# EAGLE design my-forecast (EAGLE 7.7.0)
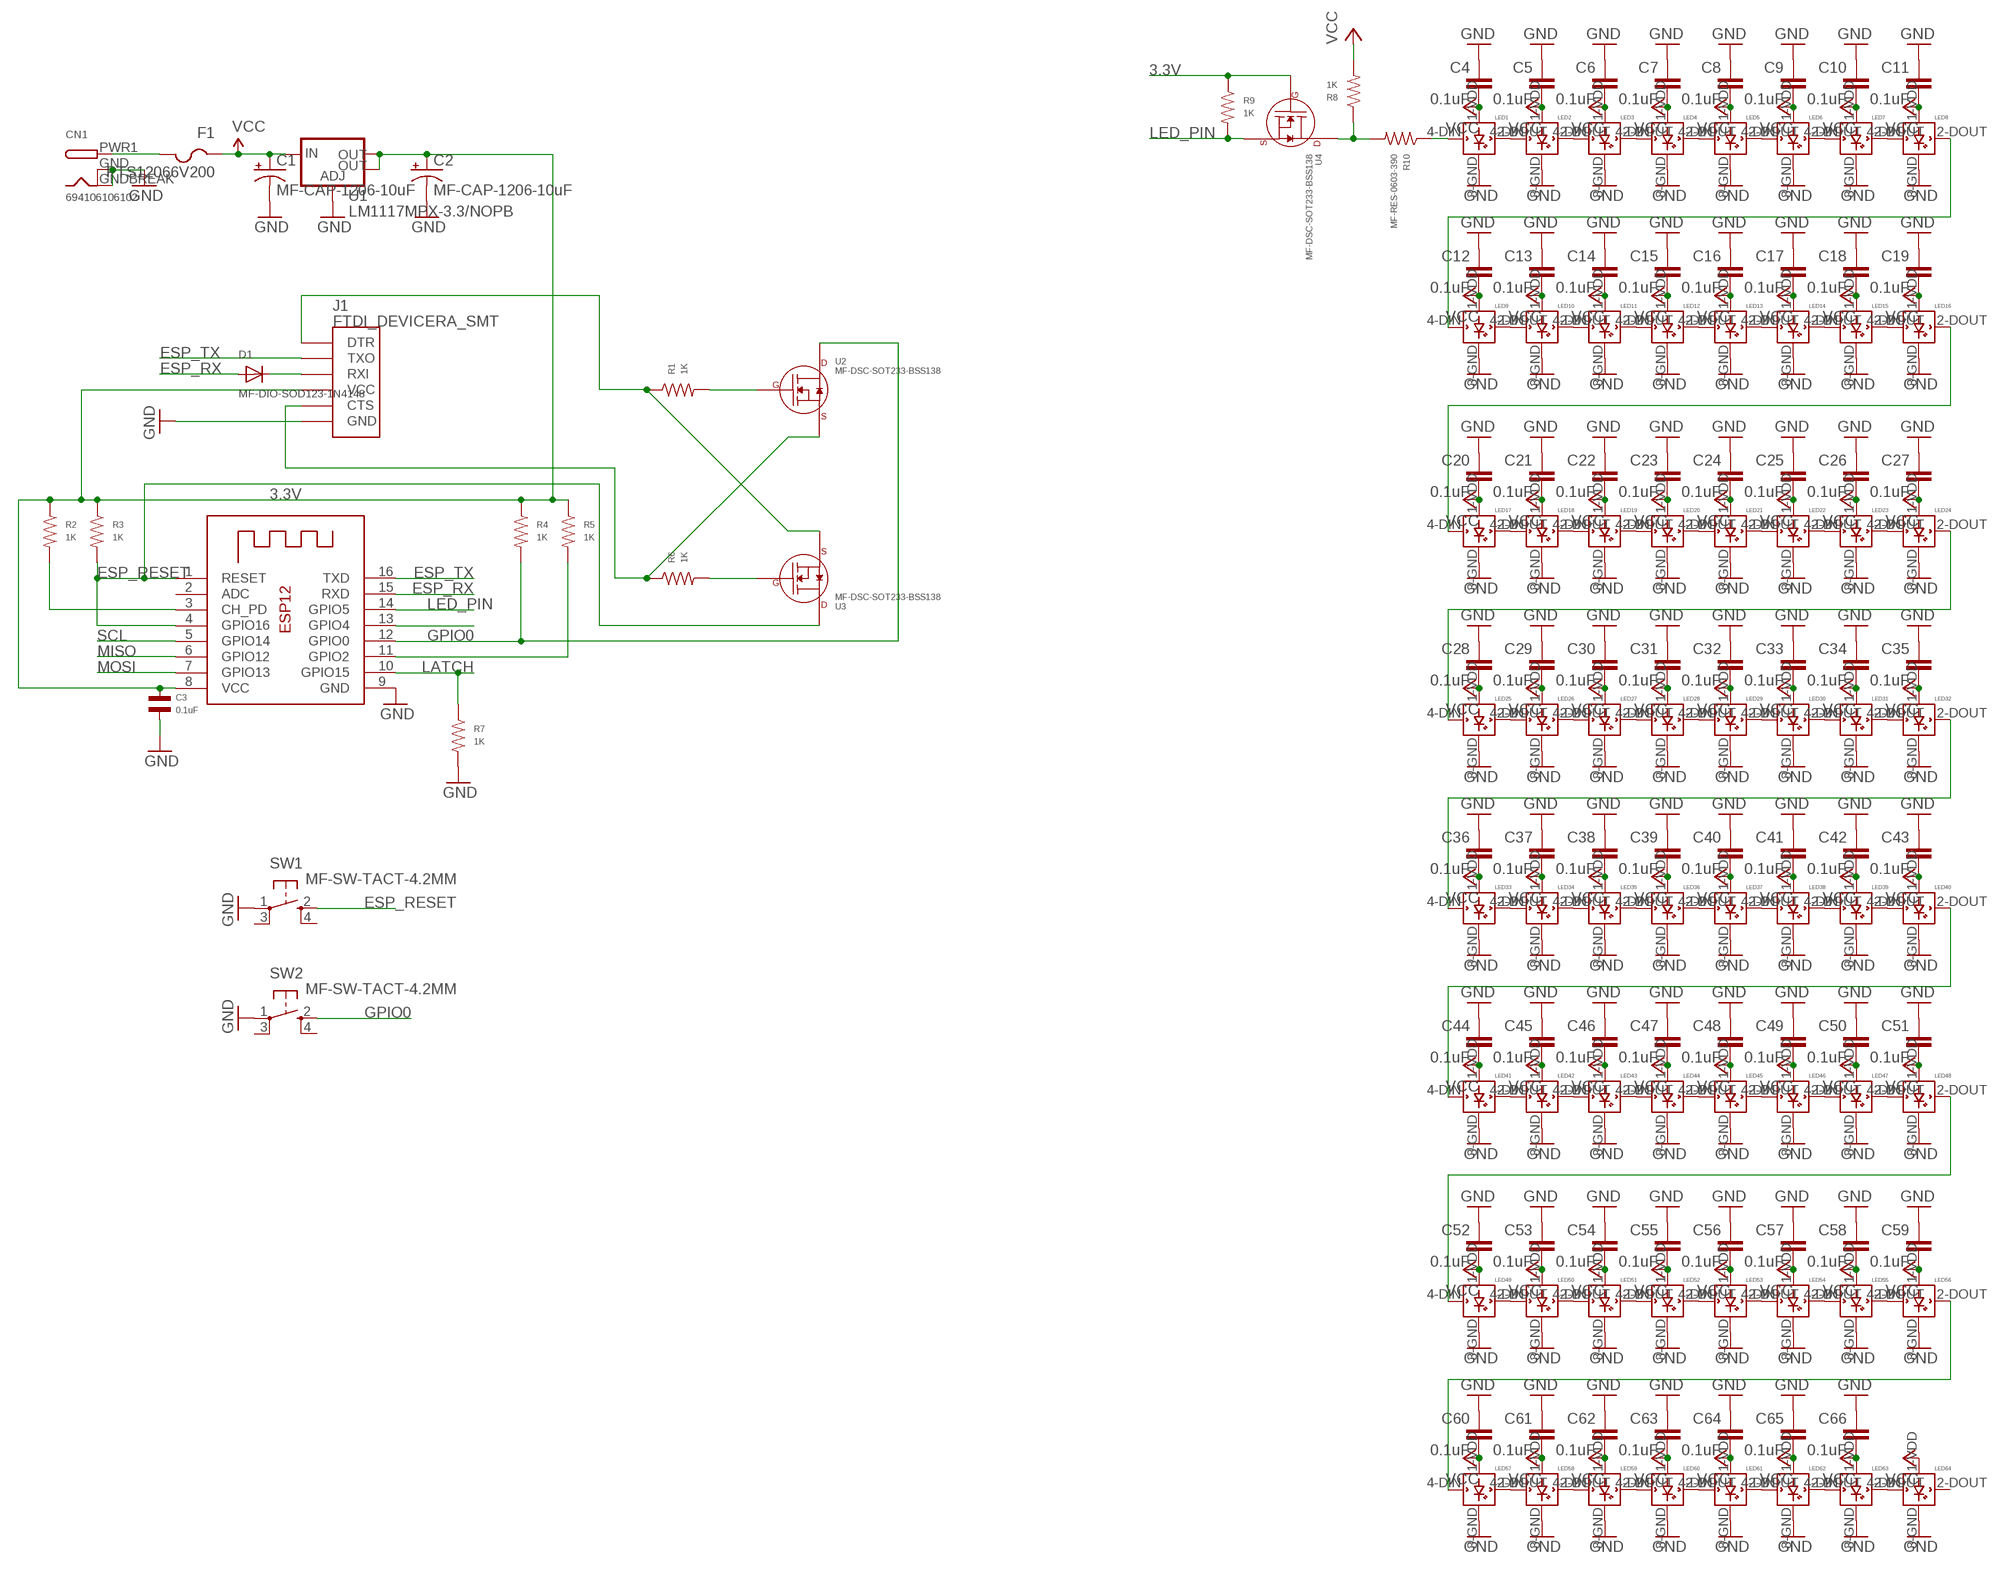
[diagram p0: schematic, sheet 1]

## Parts
C1  MF-CAP-1206-10uF  CAP_POL1206  [EIA3216]
C2  MF-CAP-1206-10uF  CAP_POL1206  [EIA3216]
C3  0.1uF  CAPACITOR_NP_0603  [C0603]
C4  0.1uF  CAP0603-CAP  [0603-CAP]
C5  0.1uF  CAP0603-CAP  [0603-CAP]
C6  0.1uF  CAP0603-CAP  [0603-CAP]
C7  0.1uF  CAP0603-CAP  [0603-CAP]
C8  0.1uF  CAP0603-CAP  [0603-CAP]
C9  0.1uF  CAP0603-CAP  [0603-CAP]
C10  0.1uF  CAP0603-CAP  [0603-CAP]
C11  0.1uF  CAP0603-CAP  [0603-CAP]
C12  0.1uF  CAP0603-CAP  [0603-CAP]
C13  0.1uF  CAP0603-CAP  [0603-CAP]
C14  0.1uF  CAP0603-CAP  [0603-CAP]
C15  0.1uF  CAP0603-CAP  [0603-CAP]
C16  0.1uF  CAP0603-CAP  [0603-CAP]
C17  0.1uF  CAP0603-CAP  [0603-CAP]
C18  0.1uF  CAP0603-CAP  [0603-CAP]
C19  0.1uF  CAP0603-CAP  [0603-CAP]
C20  0.1uF  CAP0603-CAP  [0603-CAP]
C21  0.1uF  CAP0603-CAP  [0603-CAP]
C22  0.1uF  CAP0603-CAP  [0603-CAP]
C23  0.1uF  CAP0603-CAP  [0603-CAP]
C24  0.1uF  CAP0603-CAP  [0603-CAP]
C25  0.1uF  CAP0603-CAP  [0603-CAP]
C26  0.1uF  CAP0603-CAP  [0603-CAP]
C27  0.1uF  CAP0603-CAP  [0603-CAP]
C28  0.1uF  CAP0603-CAP  [0603-CAP]
C29  0.1uF  CAP0603-CAP  [0603-CAP]
C30  0.1uF  CAP0603-CAP  [0603-CAP]
C31  0.1uF  CAP0603-CAP  [0603-CAP]
C32  0.1uF  CAP0603-CAP  [0603-CAP]
C33  0.1uF  CAP0603-CAP  [0603-CAP]
C34  0.1uF  CAP0603-CAP  [0603-CAP]
C35  0.1uF  CAP0603-CAP  [0603-CAP]
C36  0.1uF  CAP0603-CAP  [0603-CAP]
C37  0.1uF  CAP0603-CAP  [0603-CAP]
C38  0.1uF  CAP0603-CAP  [0603-CAP]
C39  0.1uF  CAP0603-CAP  [0603-CAP]
C40  0.1uF  CAP0603-CAP  [0603-CAP]
C41  0.1uF  CAP0603-CAP  [0603-CAP]
C42  0.1uF  CAP0603-CAP  [0603-CAP]
C43  0.1uF  CAP0603-CAP  [0603-CAP]
C44  0.1uF  CAP0603-CAP  [0603-CAP]
C45  0.1uF  CAP0603-CAP  [0603-CAP]
C46  0.1uF  CAP0603-CAP  [0603-CAP]
C47  0.1uF  CAP0603-CAP  [0603-CAP]
C48  0.1uF  CAP0603-CAP  [0603-CAP]
C49  0.1uF  CAP0603-CAP  [0603-CAP]
C50  0.1uF  CAP0603-CAP  [0603-CAP]
C51  0.1uF  CAP0603-CAP  [0603-CAP]
C52  0.1uF  CAP0603-CAP  [0603-CAP]
C53  0.1uF  CAP0603-CAP  [0603-CAP]
C54  0.1uF  CAP0603-CAP  [0603-CAP]
C55  0.1uF  CAP0603-CAP  [0603-CAP]
C56  0.1uF  CAP0603-CAP  [0603-CAP]
C57  0.1uF  CAP0603-CAP  [0603-CAP]
C58  0.1uF  CAP0603-CAP  [0603-CAP]
C59  0.1uF  CAP0603-CAP  [0603-CAP]
C60  0.1uF  CAP0603-CAP  [0603-CAP]
C61  0.1uF  CAP0603-CAP  [0603-CAP]
C62  0.1uF  CAP0603-CAP  [0603-CAP]
C63  0.1uF  CAP0603-CAP  [0603-CAP]
C64  0.1uF  CAP0603-CAP  [0603-CAP]
C65  0.1uF  CAP0603-CAP  [0603-CAP]
C66  0.1uF  CAP0603-CAP  [0603-CAP]
CN1  694106106102  DCBARRELSMT  [DCJACK_2MM_SMT]
D1  MF-DIO-SOD123-1N4148  DIODESOD-123  [SOD-123]
F1  PTS12066V200  PTCFUSE-1206  [R1206]
J1  FTDI_DEVICERA_SMT  [FTDI_DEVICE_RA_SMT]
LED1  WS2812B5050  [WS2812B]
LED2  WS2812B5050  [WS2812B]
LED3  WS2812B5050  [WS2812B]
LED4  WS2812B5050  [WS2812B]
LED5  WS2812B5050  [WS2812B]
LED6  WS2812B5050  [WS2812B]
LED7  WS2812B5050  [WS2812B]
LED8  WS2812B5050  [WS2812B]
LED9  WS2812B5050  [WS2812B]
LED10  WS2812B5050  [WS2812B]
LED11  WS2812B5050  [WS2812B]
LED12  WS2812B5050  [WS2812B]
LED13  WS2812B5050  [WS2812B]
LED14  WS2812B5050  [WS2812B]
LED15  WS2812B5050  [WS2812B]
LED16  WS2812B5050  [WS2812B]
LED17  WS2812B5050  [WS2812B]
LED18  WS2812B5050  [WS2812B]
LED19  WS2812B5050  [WS2812B]
LED20  WS2812B5050  [WS2812B]
LED21  WS2812B5050  [WS2812B]
LED22  WS2812B5050  [WS2812B]
LED23  WS2812B5050  [WS2812B]
LED24  WS2812B5050  [WS2812B]
LED25  WS2812B5050  [WS2812B]
LED26  WS2812B5050  [WS2812B]
LED27  WS2812B5050  [WS2812B]
LED28  WS2812B5050  [WS2812B]
LED29  WS2812B5050  [WS2812B]
LED30  WS2812B5050  [WS2812B]
LED31  WS2812B5050  [WS2812B]
LED32  WS2812B5050  [WS2812B]
LED33  WS2812B5050  [WS2812B]
LED34  WS2812B5050  [WS2812B]
LED35  WS2812B5050  [WS2812B]
LED36  WS2812B5050  [WS2812B]
LED37  WS2812B5050  [WS2812B]
LED38  WS2812B5050  [WS2812B]
LED39  WS2812B5050  [WS2812B]
LED40  WS2812B5050  [WS2812B]
LED41  WS2812B5050  [WS2812B]
LED42  WS2812B5050  [WS2812B]
LED43  WS2812B5050  [WS2812B]
LED44  WS2812B5050  [WS2812B]
LED45  WS2812B5050  [WS2812B]
LED46  WS2812B5050  [WS2812B]
LED47  WS2812B5050  [WS2812B]
LED48  WS2812B5050  [WS2812B]
LED49  WS2812B5050  [WS2812B]
LED50  WS2812B5050  [WS2812B]
LED51  WS2812B5050  [WS2812B]
LED52  WS2812B5050  [WS2812B]
LED53  WS2812B5050  [WS2812B]
LED54  WS2812B5050  [WS2812B]
LED55  WS2812B5050  [WS2812B]
LED56  WS2812B5050  [WS2812B]
LED57  WS2812B5050  [WS2812B]
LED58  WS2812B5050  [WS2812B]
LED59  WS2812B5050  [WS2812B]
LED60  WS2812B5050  [WS2812B]
LED61  WS2812B5050  [WS2812B]
LED62  WS2812B5050  [WS2812B]
LED63  WS2812B5050  [WS2812B]
LED64  WS2812B5050  [WS2812B]
R1  1K  RESISTOR_0603  [R0603]
R2  1K  RESISTOR_0603  [R0603]
R3  1K  RESISTOR_0603  [R0603]
R4  1K  RESISTOR_0603  [R0603]
R5  1K  RESISTOR_0603  [R0603]
R6  1K  RESISTOR_0603  [R0603]
R7  1K  RESISTOR_0603  [R0603]
R8  1K  RESISTOR_0603  [R0603]
R9  1K  RESISTOR_0603  [R0603]
R10  MF-RES-0603-390  RESISTOR_0603  [R0603]
SW1  MF-SW-TACT-4.2MM  SPST_TACT-KMR2  [KMR2]
SW2  MF-SW-TACT-4.2MM  SPST_TACT-KMR2  [KMR2]
U1  LM1117MPX-3.3/NOPB  V_REG_LM1117SOT223  [SOT223]
U2  MF-DSC-SOT233-BSS138  N-CHANNEL_FET_BSS138_SOT-23-3  [SOT-23-3]
U3  MF-DSC-SOT233-BSS138  N-CHANNEL_FET_BSS138_SOT-23-3  [SOT-23-3]
U4  MF-DSC-SOT233-BSS138  N-CHANNEL_FET_BSS138_SOT-23-3  [SOT-23-3]
X1  ESP-12  [ESP-12]

## Nets
3.3V: C2.A(+) C3.P$1 J1.4(VCC) R2.P$1 R3.P$1 R4.P$1 R5.P$1 R9.P$1 U1.2(OUT) U1.4(OUT) U4.P$1(GATE) X1.8(VCC)
DIN: LED8.2-DOUT(DOUT) LED9.4-DIN(DIN)
DOUT: LED7.2-DOUT(DOUT) LED8.4-DIN(DIN)
ESP_RESET: R3.P$2 SW1.2(S) U3.P$3(DRAIN) X1.1(RESET) X1.4(GPIO16)
ESP_RX: D1.A X1.15(RXD)
ESP_TX: J1.2(TXO) X1.16(TXD)
GND [power]: C1.C(-) C2.C(-) C3.P$2 C4.1 C5.1 C6.1 C7.1 C8.1 C9.1 C10.1 C11.1 C12.1 C13.1 C14.1 C15.1 C16.1 C17.1 C18.1 C19.1 C20.1 C21.1 C22.1 C23.1 C24.1 C25.1 C26.1 C27.1 C28.1 C29.1 C30.1 C31.1 C32.1 C33.1 C34.1 C35.1 C36.1 C37.1 C38.1 C39.1 C40.1 C41.1 C42.1 C43.1 C44.1 C45.1 C46.1 C47.1 C48.1 C49.1 C50.1 C51.1 C52.1 C53.1 C54.1 C55.1 C56.1 C57.1 C58.1 C59.1 C60.1 C61.1 C62.1 C63.1 C64.1 C65.1 C66.1 CN1.GND(GNDBREAK) CN1.GNDBREAK(GND) J1.6(GND) LED1.3-GND(GND) LED2.3-GND(GND) LED3.3-GND(GND) LED4.3-GND(GND) LED5.3-GND(GND) LED6.3-GND(GND) LED7.3-GND(GND) LED8.3-GND(GND) LED9.3-GND(GND) LED10.3-GND(GND) LED11.3-GND(GND) LED12.3-GND(GND) LED13.3-GND(GND) LED14.3-GND(GND) LED15.3-GND(GND) LED16.3-GND(GND) LED17.3-GND(GND) LED18.3-GND(GND) LED19.3-GND(GND) LED20.3-GND(GND) LED21.3-GND(GND) LED22.3-GND(GND) LED23.3-GND(GND) LED24.3-GND(GND) LED25.3-GND(GND) LED26.3-GND(GND) LED27.3-GND(GND) LED28.3-GND(GND) LED29.3-GND(GND) LED30.3-GND(GND) LED31.3-GND(GND) LED32.3-GND(GND) LED33.3-GND(GND) LED34.3-GND(GND) LED35.3-GND(GND) LED36.3-GND(GND) LED37.3-GND(GND) LED38.3-GND(GND) LED39.3-GND(GND) LED40.3-GND(GND) LED41.3-GND(GND) LED42.3-GND(GND) LED43.3-GND(GND) LED44.3-GND(GND) LED45.3-GND(GND) LED46.3-GND(GND) LED47.3-GND(GND) LED48.3-GND(GND) LED49.3-GND(GND) LED50.3-GND(GND) LED51.3-GND(GND) LED52.3-GND(GND) LED53.3-GND(GND) LED54.3-GND(GND) LED55.3-GND(GND) LED56.3-GND(GND) LED57.3-GND(GND) LED58.3-GND(GND) LED59.3-GND(GND) LED60.3-GND(GND) LED61.3-GND(GND) LED62.3-GND(GND) LED63.3-GND(GND) LED64.3-GND(GND) R7.P$2 SW1.1(P) SW2.1(P) U1.1(ADJ) X1.9(GND)
GPIO0: R4.P$2 SW2.2(S) U2.P$3(DRAIN) X1.12(GPIO0)
LATCH: R7.P$1 X1.10(GPIO15)
LED_PIN: R9.P$2 U4.P$2(SOURCE) X1.14(GPIO5)
MISO: X1.6(GPIO12)
MOSI: X1.7(GPIO13)
N$1: LED1.4-DIN(DIN) R10.P$1
N$2: R8.P$1 R10.P$2 U4.P$3(DRAIN)
N$3: CN1.PWR1(PWR) F1.2
N$5: X1.13(GPIO4)
N$6: LED1.2-DOUT(DOUT) LED2.4-DIN(DIN)
N$7: LED2.2-DOUT(DOUT) LED3.4-DIN(DIN)
N$8: LED3.2-DOUT(DOUT) LED4.4-DIN(DIN)
N$9: LED4.2-DOUT(DOUT) LED5.4-DIN(DIN)
N$10: LED5.2-DOUT(DOUT) LED6.4-DIN(DIN)
N$11: LED6.2-DOUT(DOUT) LED7.4-DIN(DIN)
N$13: LED9.2-DOUT(DOUT) LED10.4-DIN(DIN)
N$14: LED10.2-DOUT(DOUT) LED11.4-DIN(DIN)
N$15: LED11.2-DOUT(DOUT) LED12.4-DIN(DIN)
N$16: LED12.2-DOUT(DOUT) LED13.4-DIN(DIN)
N$17: LED13.2-DOUT(DOUT) LED14.4-DIN(DIN)
N$18: LED14.2-DOUT(DOUT) LED15.4-DIN(DIN)
N$19: LED15.2-DOUT(DOUT) LED16.4-DIN(DIN)
N$21: LED16.2-DOUT(DOUT) LED17.4-DIN(DIN)
N$22: LED24.2-DOUT(DOUT) LED25.4-DIN(DIN)
N$23: LED33.2-DOUT(DOUT) LED34.4-DIN(DIN)
N$24: LED34.2-DOUT(DOUT) LED35.4-DIN(DIN)
N$25: LED35.2-DOUT(DOUT) LED36.4-DIN(DIN)
N$26: LED36.2-DOUT(DOUT) LED37.4-DIN(DIN)
N$27: LED37.2-DOUT(DOUT) LED38.4-DIN(DIN)
N$28: LED38.2-DOUT(DOUT) LED39.4-DIN(DIN)
N$29: LED39.2-DOUT(DOUT) LED40.4-DIN(DIN)
N$30: LED41.2-DOUT(DOUT) LED42.4-DIN(DIN)
N$31: LED42.2-DOUT(DOUT) LED43.4-DIN(DIN)
N$32: LED43.2-DOUT(DOUT) LED44.4-DIN(DIN)
N$33: LED44.2-DOUT(DOUT) LED45.4-DIN(DIN)
N$34: LED45.2-DOUT(DOUT) LED46.4-DIN(DIN)
N$35: LED46.2-DOUT(DOUT) LED47.4-DIN(DIN)
N$36: LED47.2-DOUT(DOUT) LED48.4-DIN(DIN)
N$37: LED40.2-DOUT(DOUT) LED41.4-DIN(DIN)
N$38: LED48.2-DOUT(DOUT) LED49.4-DIN(DIN)
N$39: LED56.2-DOUT(DOUT) LED57.4-DIN(DIN)
N$40: LED32.2-DOUT(DOUT) LED33.4-DIN(DIN)
N$41: LED25.2-DOUT(DOUT) LED26.4-DIN(DIN)
N$42: LED26.2-DOUT(DOUT) LED27.4-DIN(DIN)
N$43: LED27.2-DOUT(DOUT) LED28.4-DIN(DIN)
N$44: LED28.2-DOUT(DOUT) LED29.4-DIN(DIN)
N$45: LED29.2-DOUT(DOUT) LED30.4-DIN(DIN)
N$46: LED30.2-DOUT(DOUT) LED31.4-DIN(DIN)
N$47: LED31.2-DOUT(DOUT) LED32.4-DIN(DIN)
N$48: LED49.2-DOUT(DOUT) LED50.4-DIN(DIN)
N$49: LED50.2-DOUT(DOUT) LED51.4-DIN(DIN)
N$50: LED51.2-DOUT(DOUT) LED52.4-DIN(DIN)
N$51: LED52.2-DOUT(DOUT) LED53.4-DIN(DIN)
N$52: LED53.2-DOUT(DOUT) LED54.4-DIN(DIN)
N$53: LED54.2-DOUT(DOUT) LED55.4-DIN(DIN)
N$54: LED55.2-DOUT(DOUT) LED56.4-DIN(DIN)
N$55: LED57.2-DOUT(DOUT) LED58.4-DIN(DIN)
N$56: LED58.2-DOUT(DOUT) LED59.4-DIN(DIN)
N$57: LED59.2-DOUT(DOUT) LED60.4-DIN(DIN)
N$58: LED60.2-DOUT(DOUT) LED61.4-DIN(DIN)
N$59: LED61.2-DOUT(DOUT) LED62.4-DIN(DIN)
N$60: LED62.2-DOUT(DOUT) LED63.4-DIN(DIN)
N$63: LED63.2-DOUT(DOUT) LED64.4-DIN(DIN)
N$64: LED17.2-DOUT(DOUT) LED18.4-DIN(DIN)
N$65: LED18.2-DOUT(DOUT) LED19.4-DIN(DIN)
N$66: LED19.2-DOUT(DOUT) LED20.4-DIN(DIN)
N$67: LED20.2-DOUT(DOUT) LED21.4-DIN(DIN)
N$68: LED21.2-DOUT(DOUT) LED22.4-DIN(DIN)
N$69: LED22.2-DOUT(DOUT) LED23.4-DIN(DIN)
N$70: LED23.2-DOUT(DOUT) LED24.4-DIN(DIN)
N$71: R6.P$2 U3.P$1(GATE)
N$74: R1.P$2 U2.P$1(GATE)
N$76: J1.5(CTS) R6.P$1 U2.P$2(SOURCE)
N$94: R2.P$2 X1.3(CH_PD)
N$95: J1.1(DTR) R1.P$1 U3.P$2(SOURCE)
N$98: D1.C J1.3(RXI)
N$99: R5.P$2 X1.11(GPIO2)
SCL: X1.5(GPIO14)
VCC [power]: C1.A(+) C4.2 C5.2 C6.2 C7.2 C8.2 C9.2 C10.2 C11.2 C12.2 C13.2 C14.2 C15.2 C16.2 C17.2 C18.2 C19.2 C20.2 C21.2 C22.2 C23.2 C24.2 C25.2 C26.2 C27.2 C28.2 C29.2 C30.2 C31.2 C32.2 C33.2 C34.2 C35.2 C36.2 C37.2 C38.2 C39.2 C40.2 C41.2 C42.2 C43.2 C44.2 C45.2 C46.2 C47.2 C48.2 C49.2 C50.2 C51.2 C52.2 C53.2 C54.2 C55.2 C56.2 C57.2 C58.2 C59.2 C60.2 C61.2 C62.2 C63.2 C64.2 C65.2 C66.2 F1.1 LED1.1-VDD(VDD) LED2.1-VDD(VDD) LED3.1-VDD(VDD) LED4.1-VDD(VDD) LED5.1-VDD(VDD) LED6.1-VDD(VDD) LED7.1-VDD(VDD) LED8.1-VDD(VDD) LED9.1-VDD(VDD) LED10.1-VDD(VDD) LED11.1-VDD(VDD) LED12.1-VDD(VDD) LED13.1-VDD(VDD) LED14.1-VDD(VDD) LED15.1-VDD(VDD) LED16.1-VDD(VDD) LED17.1-VDD(VDD) LED18.1-VDD(VDD) LED19.1-VDD(VDD) LED20.1-VDD(VDD) LED21.1-VDD(VDD) LED22.1-VDD(VDD) LED23.1-VDD(VDD) LED24.1-VDD(VDD) LED25.1-VDD(VDD) LED26.1-VDD(VDD) LED27.1-VDD(VDD) LED28.1-VDD(VDD) LED29.1-VDD(VDD) LED30.1-VDD(VDD) LED31.1-VDD(VDD) LED32.1-VDD(VDD) LED33.1-VDD(VDD) LED34.1-VDD(VDD) LED35.1-VDD(VDD) LED36.1-VDD(VDD) LED37.1-VDD(VDD) LED38.1-VDD(VDD) LED39.1-VDD(VDD) LED40.1-VDD(VDD) LED41.1-VDD(VDD) LED42.1-VDD(VDD) LED43.1-VDD(VDD) LED44.1-VDD(VDD) LED45.1-VDD(VDD) LED46.1-VDD(VDD) LED47.1-VDD(VDD) LED48.1-VDD(VDD) LED49.1-VDD(VDD) LED50.1-VDD(VDD) LED51.1-VDD(VDD) LED52.1-VDD(VDD) LED53.1-VDD(VDD) LED54.1-VDD(VDD) LED55.1-VDD(VDD) LED56.1-VDD(VDD) LED57.1-VDD(VDD) LED58.1-VDD(VDD) LED59.1-VDD(VDD) LED60.1-VDD(VDD) LED61.1-VDD(VDD) LED62.1-VDD(VDD) LED63.1-VDD(VDD) LED64.1-VDD(VDD) R8.P$2 U1.3(IN)
Unconnected: LED64.2-DOUT(DOUT) SW1.3(P1) SW1.4(S1) SW2.3(P1) SW2.4(S1) X1.2(ADC)

## Library data of the parts
C1 C2 = SparkFun-Capacitors:CAP_POL: Capacitor Polarized These are standard SMD and PTH capacitors. Normally 10uF, 47uF, and 100uF in electrolytic and tantalum varieties. Always verify the external diameter of the through hole cap, it varies with capacity, voltage, and manufacturer. The EIA devices should be standard.
C3 = MF_Passives:CAPACITOR_NP: Library: MF_Passives Description: Device for Non-Polarized Capacitors. Manufacture part number (MPN) can be added via Attributes. Check https://factory.macrofab.com/parts for the house parts list.; POPULATE: 1
C4-C66 = SparkFun-Capacitors:CAP: Capacitor Standard 0603 ceramic capacitor, and 0.1" leaded capacitor.
CN1 = adafruit:DCBARREL: 2.0mm DC Barrel Jack DCJACK_2MM_PTH - Through Hole Jack (4UConnector: 05537)
D1 = adafruit:DIODE: Diode SMADIODE - SMA Surface Mount Package 20V 1A Schottky Diode Digikey: 641-1014-6-ND DO-1N4148 - Through Hole Small Current Diode SOD-123 20V 1 A (.5mV Vf) Schottky Diode - Digikey: MBRX120TPMSCT-ND SOD-323 10V 570mA (.38mV Vf, 3ns) Schottky Diode - Digikey: ZLLS410CT-ND SOD-523 30V 30mA Schottky Diode (RB751S-40TE61) - Digikey: RB751S-40TE61CT-ND SOT23-R/W - SOT23 Package (R = Solder Paste/Reflow Ovens, W = Hand-Soldering) BAT54Film 40V 300mA - Digikey: 497-7162-1-ND
F1 = adafruit:PTCFUSE: PTC fuses, resettable thermistors
J1 = SparkFun-Connectors:FTDI_DEVICE: Connector which mates to FTDI basic or FTDI cable.; PROD_ID: CONN-08971
LED1-LED64 = adafruit:WS2812B
R1-R10 = MF_Passives:RESISTOR: Library: MF_Passives Description: Device for Resistors. Manufacture part number (MPN), Voltage, Tolerance, and Wattage Rating can be added via Attributes. Check https://factory.macrofab.com/parts for the house parts list.; POPULATE: 1
SW1 SW2 = adafruit:SPST_TACT: SMT 6mm switch, EVQQ2 series http://www.ladyada.net/library/eagle
U1 = SparkFun-PowerIC:V_REG_LM1117: Voltage Regulator LM1117 Standard adjustable voltage regulator but in SMD form. Spark Fun Electronics SKU : COM-00595; PROD_ID: VREG-08170
U2-U4 = MF_Discrete_Semiconductor:N-CHANNEL_FET: Library: MF_Discrete_Semiconductor Description: Device for Single N-Channel Mosfet. Manufacture part number (MFG#) can be added via Attributes.; HOUSEPART: YES; MPN: MF-DSC-SOT233-BSS138; POPULATE: 1; URL: https://factory.macrofab.com/part/MF-DSC-SOT233-BSS138
X1 = adafruit:ESP-12

## Net classes
2 power: width 0.254 mm

## Board
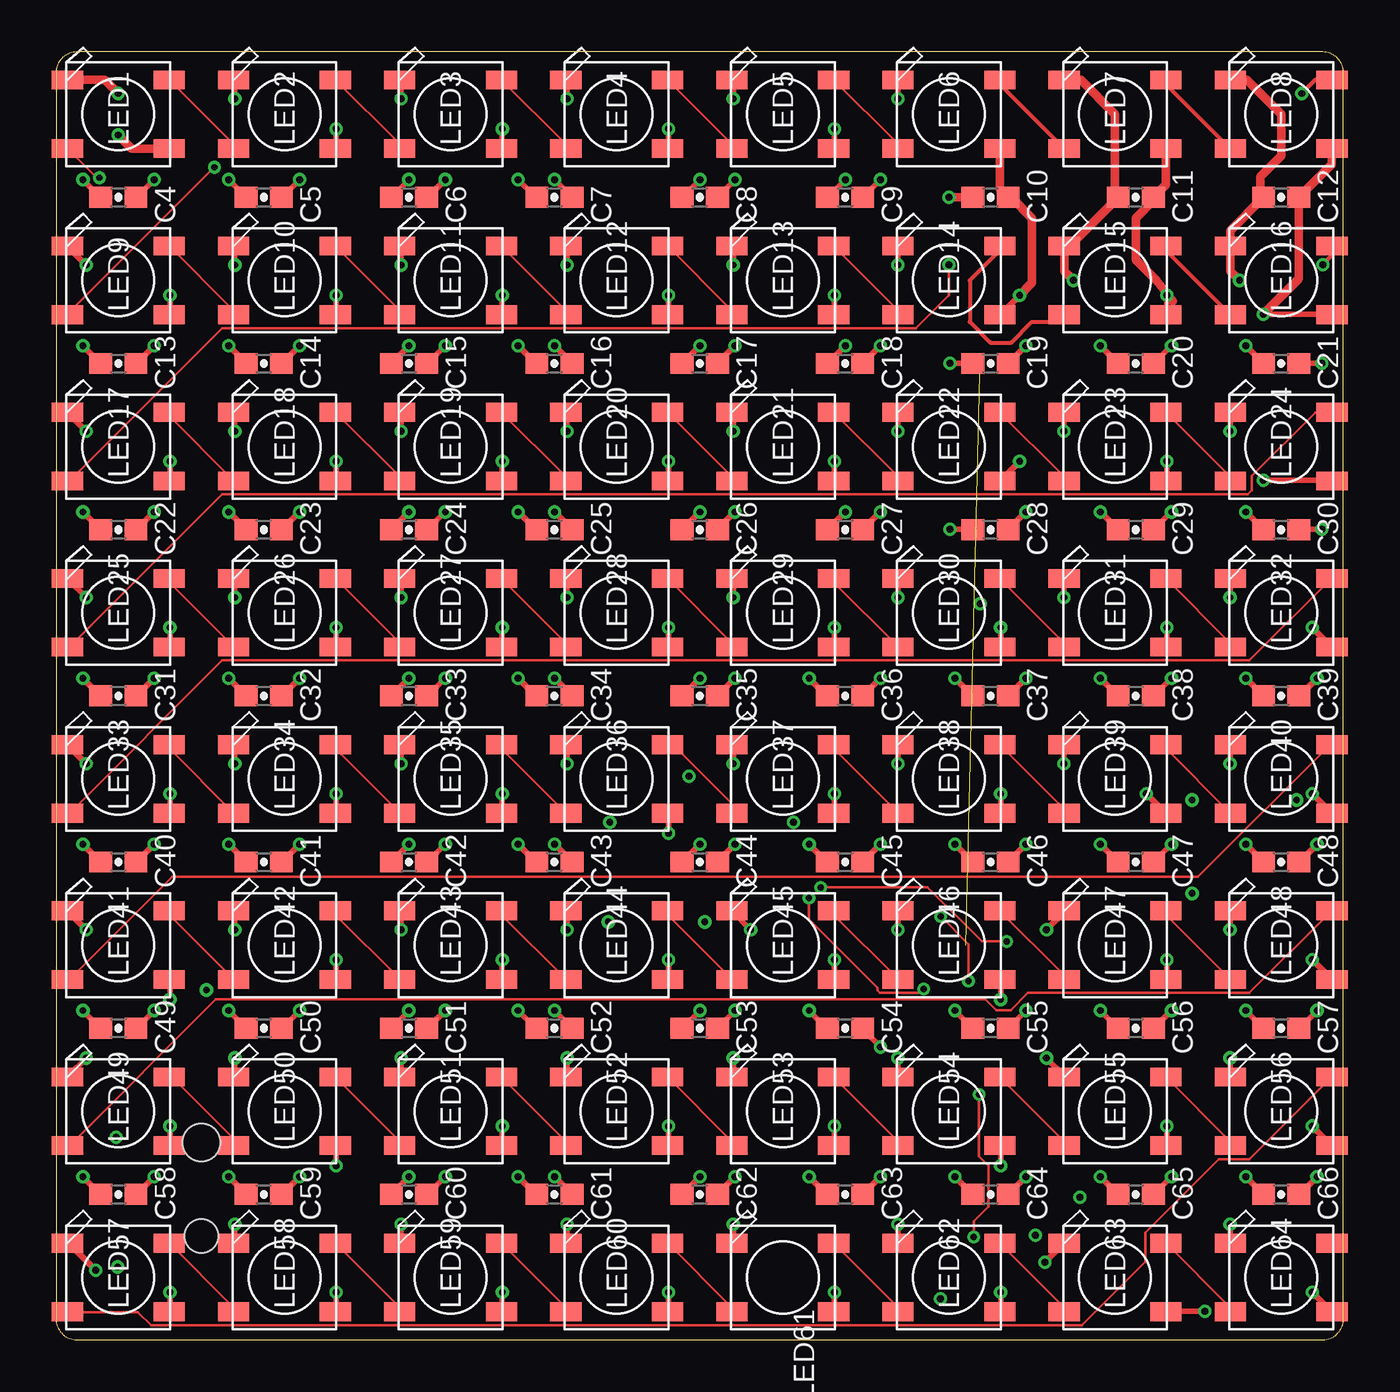
[diagram p1: board, top side]
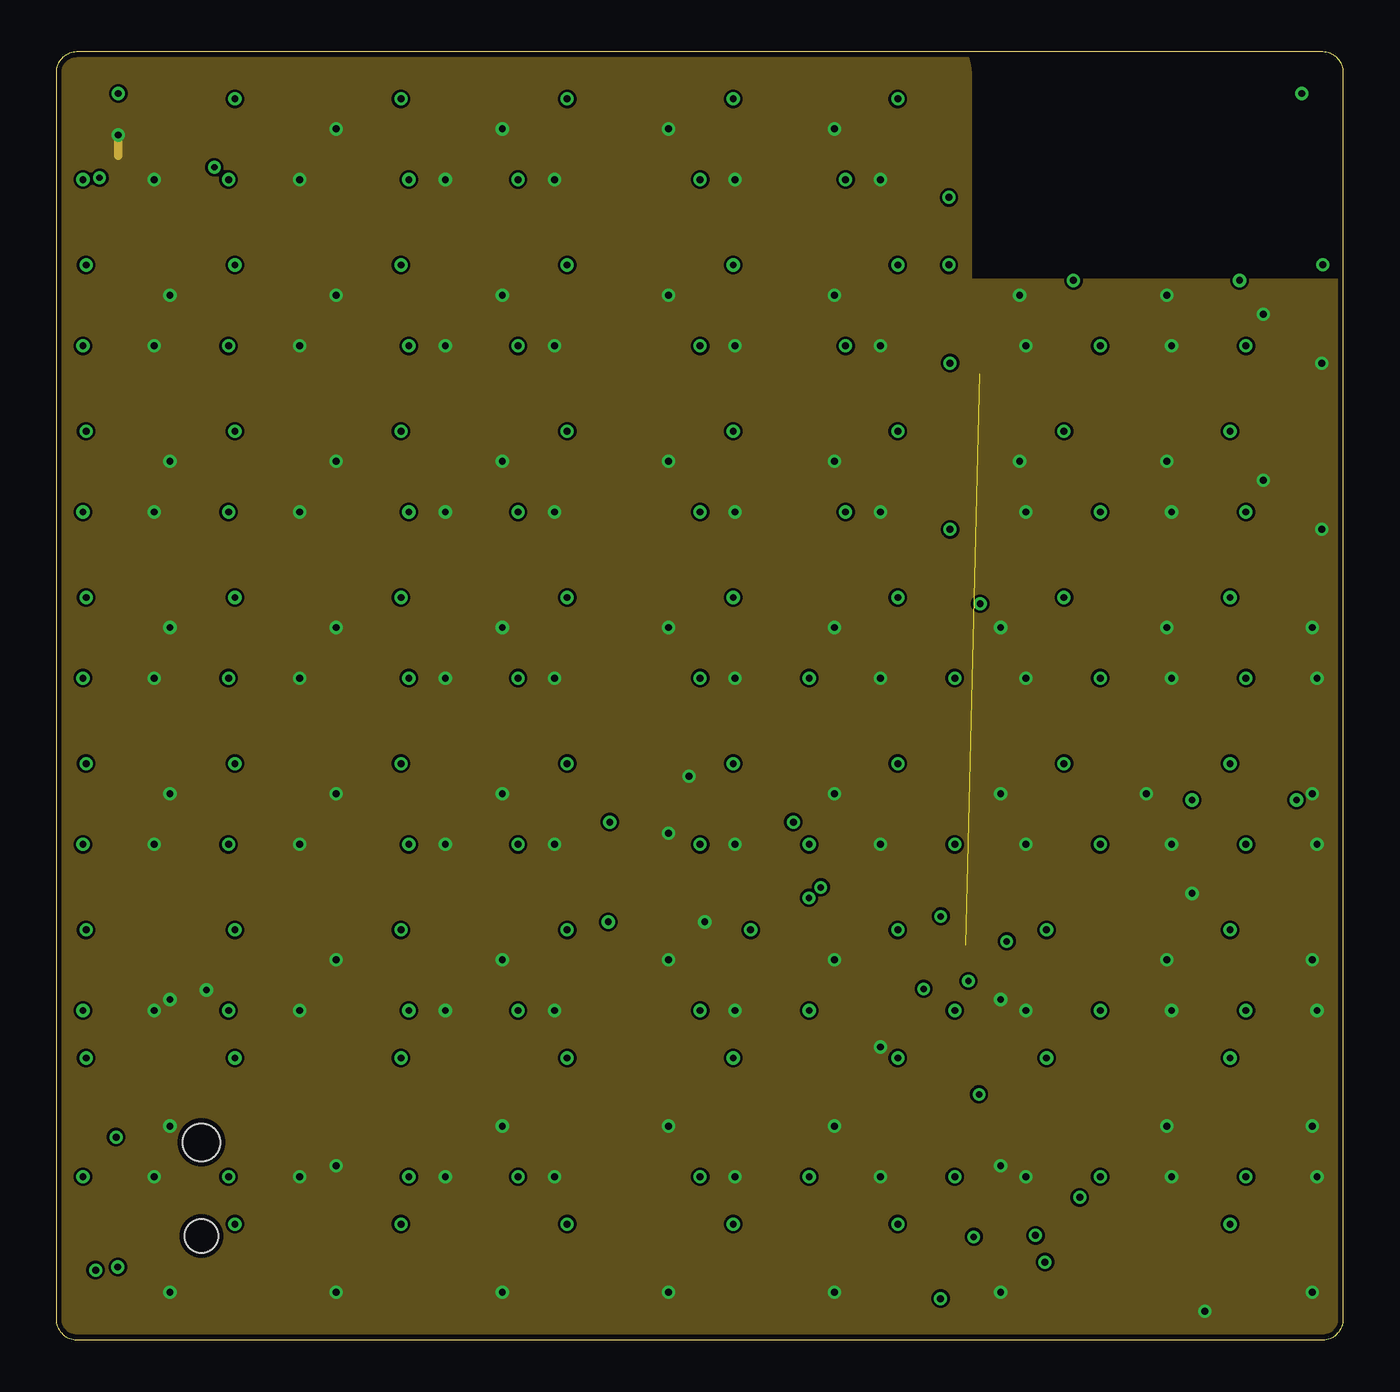
[diagram p2: board, inner layer Route2]
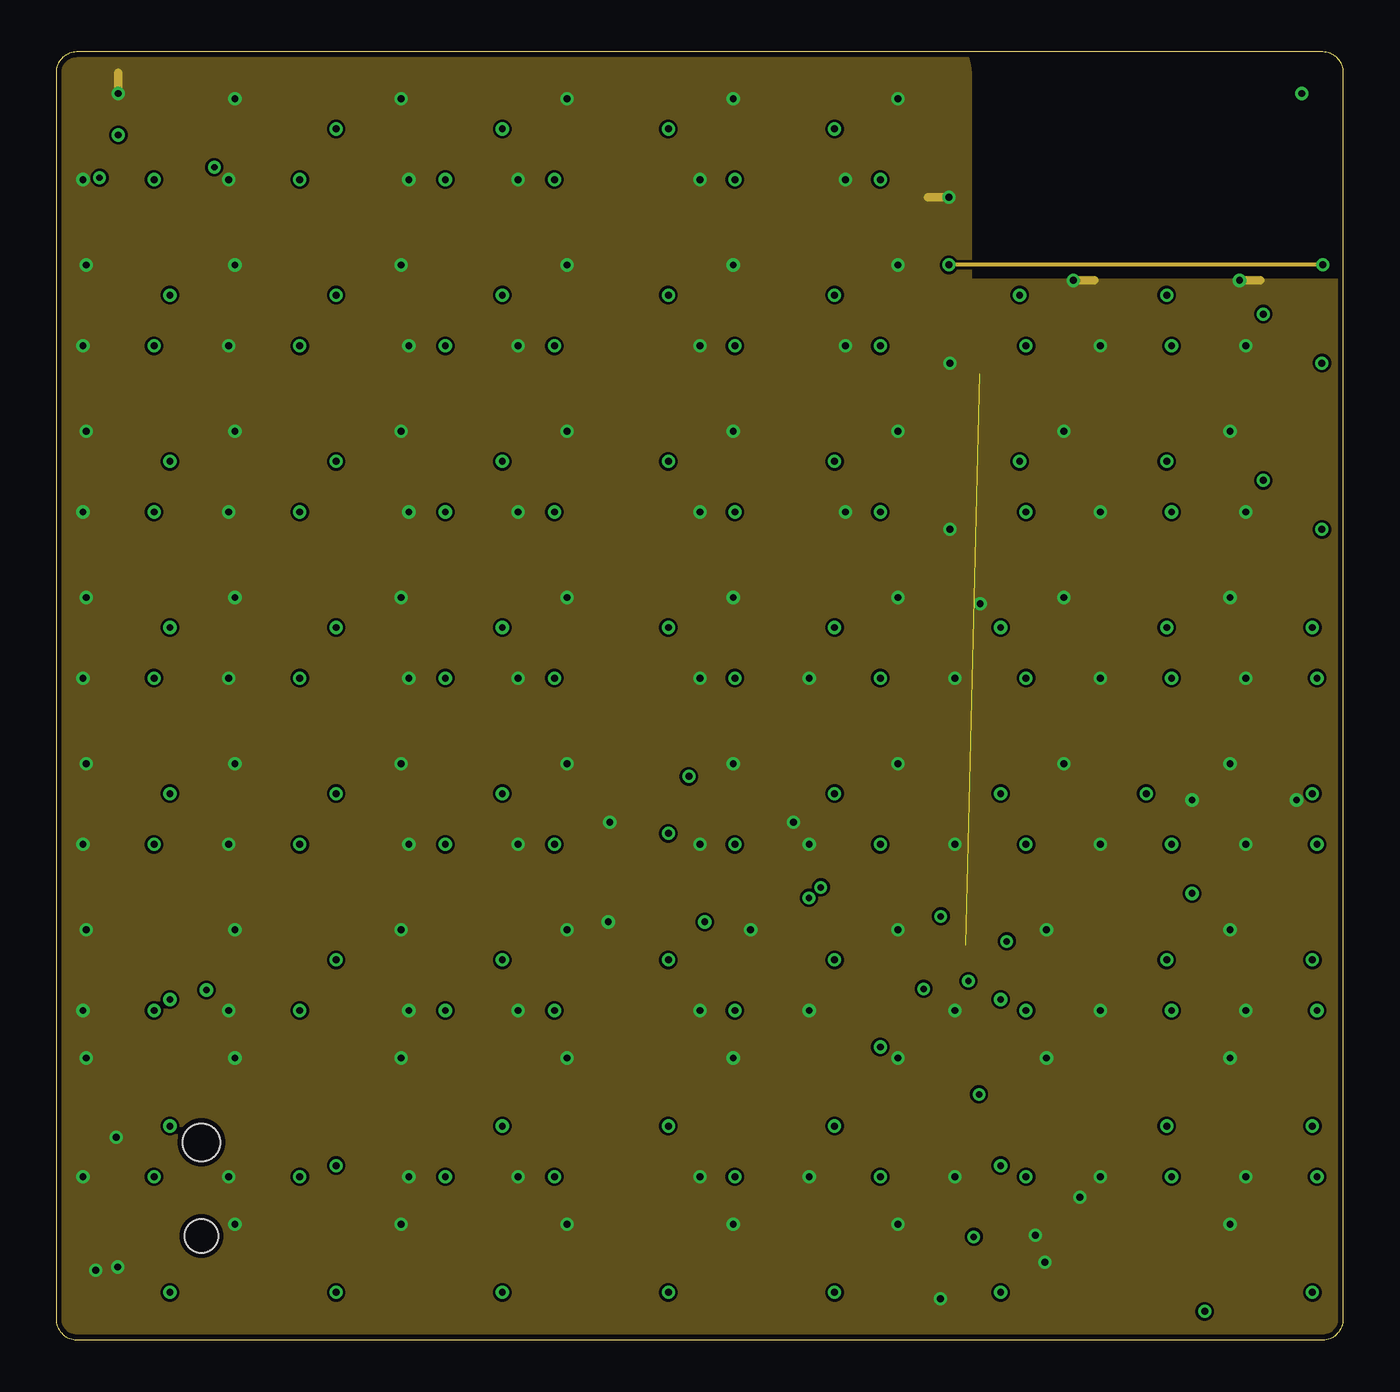
[diagram p3: board, inner layer Route15]
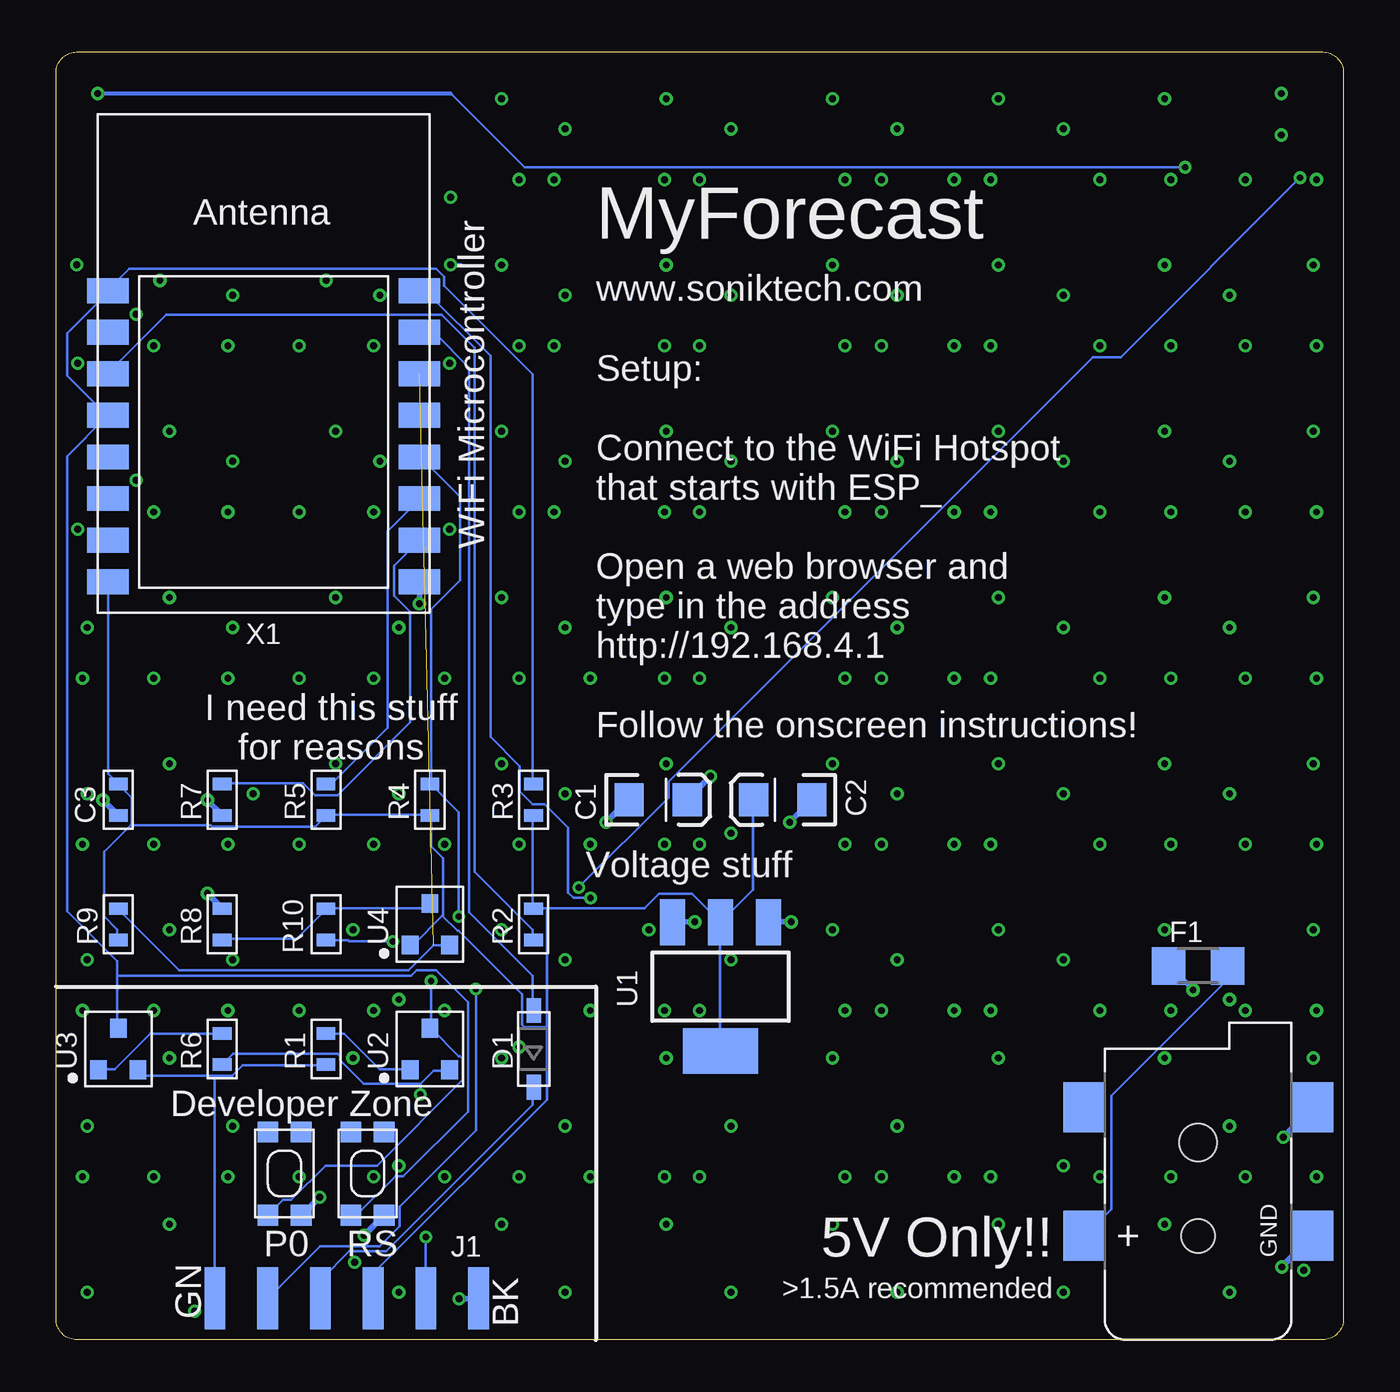
[diagram p4: board, bottom side, seen from below]

Size 62 x 62 mm. Coordinates in mm from the lower left corner, seen from the top.
Outline: 0,61 0,1 arc90 1,0 61,0 arc90 62,1 62,61 arc90 61,62 1,62 arc90 0,61
Copper layers (1*2*15*16): Top 0.035mm / dielectric 0.23mm / Route2 0.035mm / dielectric 0.93mm / Route15 0.035mm / dielectric 0.23mm / Bottom 0.035mm
Design rules "MF_Standard_4_Layer": minimum track width 5mil, minimum drill 12mil, track to track 5mil, track to pad 5mil, pad to pad 5mil, via to via 5mil, smd to smd 0mil, copper to edge 10mil, drill to drill 10mil, minimum pad ring 6mil, minimum via ring 6mil, stop-mask expansion 2mil, vias tented up to drill 25mil, thermal gap 10mil

### Footprints (pad centres in the part's own frame; a part is rotated, then mirrored left to right if it is on the bottom)
EIA3216 = smd 1.4 x 1.6: A 1.4,0; C -1.4,0
C0603 = smd 0.6 x 0.9: P$1 -0.75,0; P$2 0.75,0
0603-CAP = smd 1.1 x 1: 1 -0.85,0; 2 0.85,0
DCJACK_2MM_SMT = smd 2.4 x 2: GND 0,-5.5; GNDBREAK 6.2,-5.5; PWR1 0,5.5; PWR2 6.2,5.5 | hole 1.6: 0,0 | hole 1.8: 4.5,0
SOD-123 = smd 1.2 x 0.7: A 1.85,0; C -1.85,0
R1206 = smd 1.6 x 1.803: 1 -1.422,0; 2 1.422,0
FTDI_DEVICE_RA_SMT = smd 1 x 3: 1 -6.35,5; 2 -3.81,5; 3 -1.27,5; 4 1.27,5; 5 3.81,5; 6 6.35,5
WS2812B = smd 1.5 x 0.9: 1-VDD -2.45,1.65; 2-DOUT -2.45,-1.65; 3-GND 2.45,-1.65; 4-DIN 2.45,1.65
R0603 = smd 0.6 x 0.9: P$1 -0.75,0; P$2 0.75,0
KMR2 = smd 1 x 1: 1 2,0.8; 2 2,-0.8; 3 -2,0.8; 4 -2,-0.8
SOT223 = smd 1.219 x 2.235: 1 -2.311,-3.099; 2 0,-3.099; 3 2.311,-3.099 | smd 3.6 x 2.2: 4 0,3.099
SOT-23-3 = smd 0.9 x 0.8: P$1 -1,0.95; P$2 -1,-0.95; P$3 1,0
ESP-12 = smd 2 x 1.2: 1 -7.5,4.5; 2 -7.5,2.5; 3 -7.5,0.5; 4 -7.5,-1.5; 5 -7.5,-3.5; 6 -7.5,-5.5; 7 -7.5,-7.5; 8 -7.5,-9.5; 9 7.5,-9.5; 10 7.5,-7.5; 11 7.5,-5.5; 12 7.5,-3.5; 13 7.5,-1.5; 14 7.5,0.5; 15 7.5,2.5; 16 7.5,4.5

### Placement (x,y rotation side)
C1  33,26 0 bottom
C2  27,26 180 bottom
C3  59,26 270 bottom
C4  3,55 0 top
C5  10,55 0 top
C6  17,55 0 top
C7  24,55 0 top
C8  31,55 0 top
C9  38,55 0 top
C10  45,55 0 top
C11  52,55 0 top
C12  59,55 0 top
C13  3,47 0 top
C14  10,47 0 top
C15  17,47 0 top
C16  24,47 0 top
C17  31,47 0 top
C18  38,47 0 top
C19  45,47 0 top
C20  52,47 0 top
C21  59,47 0 top
C22  3,39 0 top
C23  10,39 0 top
C24  17,39 0 top
C25  24,39 0 top
C26  31,39 0 top
C27  38,39 0 top
C28  45,39 0 top
C29  52,39 0 top
C30  59,39 0 top
C31  3,31 0 top
C32  10,31 0 top
C33  17,31 0 top
C34  24,31 0 top
C35  31,31 0 top
C36  38,31 0 top
C37  45,31 0 top
C38  52,31 0 top
C39  59,31 0 top
C40  3,23 0 top
C41  10,23 0 top
C42  17,23 0 top
C43  24,23 0 top
C44  31,23 0 top
C45  38,23 0 top
C46  45,23 0 top
C47  52,23 0 top
C48  59,23 0 top
C49  3,15 0 top
C50  10,15 0 top
C51  17,15 0 top
C52  24,15 0 top
C53  31,15 0 top
C54  38,15 0 top
C55  45,15 0 top
C56  52,15 0 top
C57  59,15 0 top
C58  3,7 0 top
C59  10,7 0 top
C60  17,7 0 top
C61  24,7 0 top
C62  31,7 0 top
C63  38,7 0 top
C64  45,7 0 top
C65  52,7 0 top
C66  59,7 0 top
CN1  7,5 90 bottom
D1  39,14 90 bottom
F1  7,18 0 bottom
J1  48,-3 0 bottom
LED1  3,59 180 top
LED2  11,59 180 top
LED3  19,59 180 top
LED4  27,59 180 top
LED5  35,59 180 top
LED6  43,59 180 top
LED7  51,59 180 top
LED8  59,59 180 top
LED9  3,51 180 top
LED10  11,51 180 top
LED11  19,51 180 top
LED12  27,51 180 top
LED13  35,51 180 top
LED14  43,51 180 top
LED15  51,51 180 top
LED16  59,51 180 top
LED17  3,43 180 top
LED18  11,43 180 top
LED19  19,43 180 top
LED20  27,43 180 top
LED21  35,43 180 top
LED22  43,43 180 top
LED23  51,43 180 top
LED24  59,43 180 top
LED25  3,35 180 top
LED26  11,35 180 top
LED27  19,35 180 top
LED28  27,35 180 top
LED29  35,35 180 top
LED30  43,35 180 top
LED31  51,35 180 top
LED32  59,35 180 top
LED33  3,27 180 top
LED34  11,27 180 top
LED35  19,27 180 top
LED36  27,27 180 top
LED37  35,27 180 top
LED38  43,27 180 top
LED39  51,27 180 top
LED40  59,27 180 top
LED41  3,19 180 top
LED42  11,19 180 top
LED43  19,19 180 top
LED44  27,19 180 top
LED45  35,19 180 top
LED46  43,19 180 top
LED47  51,19 180 top
LED48  59,19 180 top
LED49  3,11 180 top
LED50  11,11 180 top
LED51  19,11 180 top
LED52  27,11 180 top
LED53  35,11 180 top
LED54  43,11 180 top
LED55  51,11 180 top
LED56  59,11 180 top
LED57  3,3 180 top
LED58  11,3 180 top
LED59  19,3 180 top
LED60  27,3 180 top
LED61  35,3 180 top
LED62  43,3 180 top
LED63  51,3 180 top
LED64  59,3 180 top
R1  49,14 90 bottom
R2  39,20 270 bottom
R3  39,26 90 bottom
R4  44,26 90 bottom
R5  49,26 90 bottom
R6  54,14 90 bottom
R7  54,26 270 bottom
R8  54,20 90 bottom
R9  59,20 90 bottom
R10  49,20 90 bottom
SW1  47,8 270 bottom
SW2  51,8 270 bottom
U1  30,17 180 bottom
U2  44,14 90 bottom
U3  59,14 90 bottom
U4  44,20 90 bottom
X1  52,46 0 bottom

### Tracks (layer width: path | path; a pad name or v marks a point on that pad's centre or on a via)
3.3V
  Bottom 0.127: 58.39,24.8 58.36,24.83 58.36,26.1 58.99,26.73 C3.P$1 59.05,26.8 59.5,27.24 59.5,36.45 X1.8 | 58.39,24.8 59.69,23.5 59.69,20.38 59.05,19.75 59.05,19.3 R9.P$1 | 43.4,20.41 43.37,20.45 43.37,23.18 43.94,23.75 43.94,25.21 R4.P$1 44.01,25.27 48.96,25.27 R5.P$1 49.02,25.21 49.53,24.7 54.48,24.7 54.55,24.77 58.36,24.77 58.39,24.8 | 43.4,20.41 44.77,19.05 44.9,19.05 U4.P$1 | R3.P$1 39.05,25.21 39.05,20.77 R2.P$1 38.99,20.77 38.35,20.77 | C2.A 28.45,25.97 28.45,21.65 29.97,20.13 U1.2 | 38.35,20.77 33.66,20.77 32.96,21.46 31.37,21.46 30.04,20.13 U1.2 | 38.35,20.77 38.35,15.05 | 38.35,15.05 38.35,11.56 46.67,3.24 46.67,2.03 J1.4 | U1.4 30.04,13.91 30.04,20.07 U1.2 | 43.4,20.41 42.67,19.68 42.61,19.68 39.56,16.64 39.56,15.18 39.43,15.05 38.35,15.05
DIN  (via drill 0.3, 0.33)
  Top 0.127: v7.62,56.45 0.57,49.4 LED9.4-DIN
  Top 0.203: LED8.2-DOUT 60.65,60.65 v60,60
  Bottom 0.127: v7.62,56.45 39.43,56.45 42.93,59.94 43,60
  Bottom 0.203: v60,60 43,60
DOUT
  Top 0.203: 53.45,60.45 LED8.4-DIN
  Top 0.406: LED7.2-DOUT 53.45,60.45
ESP_RESET
  Bottom 0.127: R3.P$2 39.05,26.8 39.05,46.48 43.31,50.74 43.31,51.18 43.69,51.56 58.48,51.56 59.5,50.55 X1.1 59.56,50.48 59.56,50.35 61.47,48.45 61.47,46.42 59.56,44.51 X1.4 59.56,44.45 61.47,42.55 61.47,20.64 59.05,18.22 59.05,17.53 | 59.05,17.53 59.05,15.05 U3.P$3 | 59.05,17.53 44.9,17.53 44.64,17.78 43.69,17.78 42.16,16.26 42.16,10.99 45.28,7.87 45.66,7.87 47.5,6.03 47.75,6.03 SW1.2
ESP_RX
  Bottom 0.127: D1.A 39.05,15.88 39.05,17.53 42.1,20.57 42.1,46.8 43.75,48.45 44.45,48.45 X1.15
ESP_TX  (via drill 0.3)
  Top 0.127: v36.26,21.27 36.26,20.26 39.56,16.95 39.56,16.83 39.69,16.7 41.59,16.7 v41.78,16.89
  Bottom 0.127: v36.26,21.27 37.08,21.27 37.34,21.53 37.34,24.64 38.48,25.78 39.05,25.78 39.69,26.42 39.69,27.62 41.08,29.02 41.08,47.37 44.2,50.48 44.45,50.48 X1.16 | v41.78,16.89 41.78,10.1 45.47,6.41 45.47,5.46 46.42,4.51 49.28,4.51 51.75,2.03 J1.2
GND  (via drill 0.33)
  Top 0.254: v1.29,7.85 2.13,7.01 C58.1 | v8.31,7.85 C59.1 | v1.29,15.85 2.13,15.01 C49.1 | v16.99,7.85 C60.1 | v8.31,15.85 C50.1 | v1.29,23.85 2.13,23.01 C40.1 | v22.25,7.85 23.09,7.01 C61.1 | v16.99,15.85 C51.1 | v8.31,23.85 9.14,23.01 C41.1 | v1.29,31.85 2.13,31.01 C31.1 | v31.01,7.85 30.18,7.01 C62.1 | v22.25,15.85 23.09,15.01 C52.1 | v16.99,23.85 16.15,23.01 C42.1 | v8.31,31.85 9.14,31.01 C32.1 | v1.29,39.85 2.13,39.01 C22.1 | v36.27,7.85 37.11,7.01 C63.1 | v31.01,15.85 30.18,15.01 C53.1 | v22.25,23.85 23.09,23.01 C43.1 | v16.99,31.85 16.15,31.01 C33.1 | v8.31,39.85 9.14,39.01 C23.1 | v1.29,47.85 2.13,47.02 C13.1 | v43.28,7.85 44.12,7.01 C64.1 | v36.27,15.85 37.11,15.01 C54.1 | v31.01,23.85 30.18,23.01 C44.1 | v22.25,31.85 23.09,31.01 C34.1 | v16.99,39.85 16.15,39.01 C24.1 | v8.31,47.85 9.14,47.02 C14.1 | v1.29,55.85 C4.1 | v50.29,7.85 51.13,7.01 C65.1 | v43.28,15.85 44.12,15.01 C55.1 | v36.27,23.85 37.11,23.01 C45.1 | v31.01,31.85 30.18,31.01 C35.1 | v57.3,7.85 C66.1 | v22.25,39.85 23.09,39.01 C25.1 | v16.99,47.85 16.15,47.02 C15.1 | v8.31,55.85 9.14,55.02 C5.1 | v50.29,15.85 51.13,15.01 C56.1 | v43.28,23.85 44.12,23.01 C46.1 | v36.27,31.85 37.11,31.01 C36.1 | v31.01,39.85 30.18,39.01 C26.1 | v57.3,15.85 C57.1 | v22.25,47.85 23.09,47.02 C16.1 | v16.99,55.85 16.15,55.02 C6.1 | v50.29,23.85 51.13,23.01 C47.1 | v43.28,31.85 44.12,31.01 C37.1 | v38.02,39.85 37.19,39.01 C27.1 | v31.01,47.85 30.18,47.02 C17.1 | v22.25,55.85 23.09,55.02 C7.1 | v57.3,23.85 58.14,23.01 C48.1 | v50.29,31.85 51.13,31.01 C38.1 | v43.05,39.01 44.12,39.01 C28.1 | v38.02,47.85 37.19,47.02 C18.1 | v31.01,55.85 30.18,55.02 C8.1 | v57.3,31.85 58.14,31.01 C39.1 | v50.29,39.85 51.13,39.01 C29.1
  Top 0.254: v43.05,47.02 44.12,47.02 C19.1 | v38.02,55.85 37.19,55.02 C9.1 | v57.3,39.85 58.14,39.01 C30.1 | v50.29,47.85 51.13,47.02 C20.1 | v57.3,47.85 58.14,47.02 C21.1 | v1.91,3.35 0.61,4.65 LED57.3-GND | v8.61,5.56 8.61,4.72 LED58.3-GND | v1.45,13.56 0.61,12.72 LED49.3-GND | v16.61,5.56 16.61,4.72 LED59.3-GND | v8.61,13.56 8.61,12.72 LED50.3-GND | v1.45,19.74 0.61,20.57 LED41.3-GND | v24.61,5.56 24.61,4.72 LED60.3-GND | v16.61,13.56 16.61,12.72 LED51.3-GND | v8.61,19.74 8.61,20.57 LED42.3-GND | v1.45,27.74 0.61,28.57 LED33.3-GND | v32.61,5.56 32.61,4.72 LED61.3-GND | v24.61,13.56 24.61,12.72 LED52.3-GND | v16.61,19.74 16.61,20.57 LED43.3-GND | v8.61,27.74 8.61,28.57 LED34.3-GND | v1.45,35.74 0.61,36.58 LED25.3-GND | v40.54,5.56 40.54,4.72 LED62.3-GND | v32.61,13.56 32.61,12.72 LED53.3-GND | v24.61,19.74 24.61,20.57 LED44.3-GND | v16.61,27.74 16.61,28.57 LED35.3-GND | v8.61,35.74 8.61,36.58 LED26.3-GND | v1.45,43.74 0.61,44.58 LED17.3-GND | v40.54,13.56 40.54,12.72 LED54.3-GND | v47.62,3.73 LED63.3-GND | v33.45,19.74 32.61,20.57 LED45.3-GND | v24.61,27.74 24.61,28.57 LED36.3-GND | v16.61,35.74 16.61,36.58 LED27.3-GND | v8.61,43.74 8.61,44.58 LED18.3-GND | v1.45,51.74 0.61,52.58 LED9.3-GND | v56.54,5.56 56.54,4.72 LED64.3-GND | v47.7,13.56 48.54,12.72 LED55.3-GND | v40.54,19.74 40.54,20.57 LED46.3-GND | v32.61,27.74 32.61,28.57 LED37.3-GND | v24.61,35.74 24.61,36.58 LED28.3-GND | v16.61,43.74 16.61,44.58 LED19.3-GND | v8.61,51.74 8.61,52.58 LED10.3-GND | v56.54,13.56 56.54,12.72 LED56.3-GND | v40.54,27.74 40.54,28.57 LED38.3-GND | v32.61,35.74 32.61,36.58 LED29.3-GND | v24.61,43.74 24.61,44.58 LED20.3-GND | v16.61,51.74 16.61,52.58 LED11.3-GND
  Top 0.254: v8.61,59.74 8.61,60.58 LED2.3-GND | v47.7,19.74 48.54,20.57 LED47.3-GND | v40.54,35.74 40.54,36.58 LED30.3-GND | v32.61,43.74 32.61,44.58 LED21.3-GND | v24.61,51.74 24.61,52.58 LED12.3-GND | v16.61,59.74 16.61,60.58 LED3.3-GND | v56.54,19.74 56.54,20.57 LED48.3-GND | v48.54,27.74 48.54,28.57 LED39.3-GND | v40.54,43.74 40.54,44.58 LED22.3-GND | v32.61,51.74 32.61,52.58 LED13.3-GND | v24.61,59.74 24.61,60.58 LED4.3-GND | v56.54,27.74 56.54,28.57 LED40.3-GND | v48.54,35.74 48.54,36.58 LED31.3-GND | v40.54,51.74 40.54,52.58 LED14.3-GND | v32.61,59.74 32.61,60.58 LED5.3-GND | v56.54,35.74 56.54,36.58 LED32.3-GND | v48.54,43.74 48.54,44.58 LED23.3-GND | v40.54,59.74 40.54,60.58 LED6.3-GND | v56.54,43.74 56.54,44.58 LED24.3-GND
  Top 0.406: LED1.3-GND 2.35,60.65 v3,60 | LED8.3-GND 57.35,60.65 59,59 59,57 58,56 58,55.15 C12.1 56.55,53.4 LED16.3-GND 56.55,51.45 v57,51 | LED7.3-GND 49.35,60.65 51,59 51,55.15 C11.1 48.8,52.65 LED15.3-GND 48.55,51.45 v49,51 | C10.1 v43,55
  Route15 0.406: v3,60 3,61 | v49,51 50,51 | v57,51 58,51 | v43,55 42,55
  Bottom 0.254: v54.71,25.98 54.03,25.3 R7.P$2 | v59.74,25.98 59.05,25.3 C3.P$2 | v47.17,5.03 46.25,5.94 SW1.1 | v49.3,6.86 50.14,6.02 SW2.1 | v26.67,24.92 25.6,25.98 C2.C | v35.51,24.92 34.44,25.98 C1.C | v44.5,35.43 X1.9 | v26.59,20.12 27.66,20.12 U1.1 | v2.97,3.5 1.52,4.95 CN1.GND | v2.9,9.75 1.52,11.12 CN1.GNDBREAK | v42.6,1.98 41.68,1.98 J1.6
  pour Route15: -1,63 42,63 arc-90 44,61 44,51 63,51 63,-1 -1,-1
GPIO0  (via drill 0.3)
  Top 0.127: v43.94,17.27 43.94,19.05 v42.61,20.38
  Bottom 0.127: SW2.2 51.75,6.03 51.05,6.73 50.67,6.73 49.02,8.38 46.55,8.38 42.42,12.51 42.42,13.53 42.55,13.65 42.61,13.65 43.94,14.99 U2.P$3 43.94,15.05 v43.94,17.27 | X1.12 44.45,42.48 42.55,40.58 42.55,36.58 43.94,35.18 43.94,26.8 R4.P$2 43.94,26.73 42.61,25.4 v42.61,20.38
LATCH
  Bottom 0.127: R7.P$1 53.98,26.8 50.1,26.8 49.53,26.23 48.45,26.23 44.96,29.72 44.96,35.05 45.72,35.81 45.72,37.27 44.51,38.48 X1.10
LED_PIN  (1 unrouted)
  Bottom 0.127: U4.P$2 43.05,18.99 43.81,18.99 45.02,17.78 56.07,17.78 58.99,20.7 R9.P$2
N$1  (via drill 0.3)
  Top 0.127: v45.78,19.18 44.58,19.18 41.97,21.78 v36.83,21.78 | v2.1,55.94 1.97,55.94 0.57,57.34 LED1.4-DIN
  Bottom 0.127: v45.78,19.18 47.88,19.18 47.94,19.24 48.96,19.24 R10.P$1 | v36.83,21.78 32.51,26.1 32.51,26.86 12.06,47.31 10.73,47.31 v2.1,55.94
N$2
  Bottom 0.127: U4.P$3 44.01,20.95 44.2,20.77 48.96,20.77 R10.P$2 49.02,20.7 50.42,19.3 53.98,19.3 R8.P$1
N$3
  Bottom 0.127: F1.2 5.59,17.97 5.59,17.34 11.18,11.75 11.18,6.29 12.45,5.02 CN1.PWR1
N$6
  Top 0.127: LED2.4-DIN 8.51,57.4 8.51,57.59 5.46,60.64 LED1.2-DOUT
N$7
  Top 0.127: LED3.4-DIN 16.51,57.4 16.51,57.59 13.46,60.64 LED2.2-DOUT
N$8
  Top 0.127: LED4.4-DIN 24.51,57.4 24.51,57.59 21.46,60.64 LED3.2-DOUT
N$9
  Top 0.127: LED5.4-DIN 32.51,57.4 32.51,57.59 29.46,60.64 LED4.2-DOUT
N$10
  Top 0.127: LED6.4-DIN 40.51,57.4 40.51,57.59 37.47,60.64 LED5.2-DOUT
N$11
  Top 0.203: LED6.2-DOUT 45.45,60.45 LED7.4-DIN
N$13
  Top 0.127: LED10.4-DIN 8.51,49.4 8.51,49.59 5.46,52.64 LED9.2-DOUT
N$14
  Top 0.127: LED11.4-DIN 16.51,49.4 16.51,49.59 13.46,52.64 LED10.2-DOUT
N$15
  Top 0.127: LED12.4-DIN 24.51,49.4 24.51,49.59 21.46,52.64 LED11.2-DOUT
N$16
  Top 0.127: LED13.4-DIN 32.51,49.4 32.51,49.59 29.46,52.64 LED12.2-DOUT
N$17
  Top 0.127: LED14.4-DIN 40.51,49.4 40.51,49.59 37.47,52.64 LED13.2-DOUT
N$18
  Top 0.203: LED14.2-DOUT 45.45,52.45 44,51 44,49 45,48 46,48 47,49 48.2,49 LED15.4-DIN
N$19
  Top 0.203: 53.45,52.45 LED16.4-DIN
  Top 0.406: LED15.2-DOUT 53.45,52.45
N$21  (via drill 0.33)
  Top 0.127: LED17.4-DIN 0.57,41.4 0.7,41.4 8,48.7 41.4,48.7 42.99,50.29 42.99,51.69 v43,51.75
  Top 0.203: LED16.2-DOUT 61.45,52.2 v61,51.75
  Route15 0.203: v61,51.75 v43,51.75
  Bottom 0.203: v43,51.75 42.5,51.75
N$22
  Top 0.127: LED25.4-DIN 0.57,33.4 0.7,33.4 8,40.7 57.4,40.7 57.59,40.89 57.59,41.59 60.64,44.64 61.4,44.64 LED24.2-DOUT
N$23
  Top 0.127: LED33.2-DOUT 5.46,28.64 5.46,28.45 8.51,25.4 LED34.4-DIN
N$24
  Top 0.127: LED34.2-DOUT 13.46,28.64 13.46,28.45 16.51,25.4 LED35.4-DIN
N$25
  Top 0.127: LED35.2-DOUT 21.46,28.64 21.46,28.45 24.51,25.4 LED36.4-DIN
N$26
  Top 0.127: LED36.2-DOUT 29.46,28.64 29.72,28.64 32.51,25.84 32.51,25.4 LED37.4-DIN
N$27
  Top 0.127: LED37.2-DOUT 37.47,28.64 37.47,28.45 40.51,25.4 LED38.4-DIN
N$28
  Top 0.127: LED39.4-DIN 48.51,25.4 48.51,25.59 45.47,28.64 LED38.2-DOUT
N$29
  Top 0.127: LED39.2-DOUT 53.47,28.64 53.47,28.45 56.52,25.4 LED40.4-DIN
N$30
  Top 0.127: LED41.2-DOUT 5.46,20.64 5.46,20.45 8.51,17.4 LED42.4-DIN
N$31
  Top 0.127: LED42.2-DOUT 13.46,20.64 13.46,20.45 16.51,17.4 LED43.4-DIN
N$32
  Top 0.127: LED43.2-DOUT 21.46,20.64 21.46,20.45 24.51,17.4 LED44.4-DIN
N$33
  Top 0.127: LED44.2-DOUT 29.46,20.64 29.46,20.45 32.51,17.4 LED45.4-DIN
N$34
  Top 0.127: LED45.2-DOUT 37.47,20.64 37.47,20.45 40.51,17.4 LED46.4-DIN
N$35
  Top 0.127: LED47.4-DIN 48.51,17.4 48.51,17.59 45.47,20.64 LED46.2-DOUT
N$36
  Top 0.127: LED47.2-DOUT 53.47,20.64 53.47,20.45 56.52,17.4 LED48.4-DIN
N$37
  Top 0.127: LED41.4-DIN 0.57,17.4 0.7,17.4 5.59,22.29 54.99,22.29 61.4,28.7 LED40.2-DOUT
N$38
  Top 0.127: LED49.4-DIN 0.57,9.4 0.7,9.4 7.68,16.38 44.77,16.38 45.28,15.88 45.97,15.88 46.8,16.7 57.47,16.7 61.4,20.64 LED48.2-DOUT
N$39
  Top 0.127: LED57.4-DIN 0.57,1.33 3.94,1.33 4.57,0.7 49.4,0.7 52.45,3.75 52.45,5.14 56.01,8.7 57.47,8.7 61.4,12.64 LED56.2-DOUT
N$40
  Top 0.127: LED33.4-DIN 0.57,25.4 0.7,25.4 8,32.7 57.47,32.7 61.4,36.64 LED32.2-DOUT
N$41
  Top 0.127: LED25.2-DOUT 5.46,36.64 5.46,36.45 8.51,33.4 LED26.4-DIN
N$42
  Top 0.127: LED27.4-DIN 16.51,33.4 16.51,33.59 13.46,36.64 LED26.2-DOUT
N$43
  Top 0.127: LED28.4-DIN 24.51,33.4 24.51,33.59 21.46,36.64 LED27.2-DOUT
N$44
  Top 0.127: LED29.4-DIN 32.51,33.4 32.51,33.59 29.46,36.64 LED28.2-DOUT
N$45
  Top 0.127: LED29.2-DOUT 37.47,36.64 37.47,36.45 40.51,33.4 LED30.4-DIN
N$46
  Top 0.127: LED31.4-DIN 48.51,33.4 48.51,33.59 45.47,36.64 LED30.2-DOUT
N$47
  Top 0.127: LED32.4-DIN 56.52,33.4 56.52,33.59 53.47,36.64 LED31.2-DOUT
N$48
  Top 0.127: LED50.4-DIN 8.51,9.4 8.51,9.72 5.59,12.64 5.46,12.64 LED49.2-DOUT
N$49
  Top 0.127: LED51.4-DIN 16.51,9.4 16.51,9.59 13.46,12.64 LED50.2-DOUT
N$50
  Top 0.127: LED52.4-DIN 24.51,9.4 24.51,9.59 21.46,12.64 LED51.2-DOUT
N$51
  Top 0.127: LED53.4-DIN 32.51,9.4 32.51,9.59 29.46,12.64 LED52.2-DOUT
N$52
  Top 0.127: LED54.4-DIN 40.51,9.4 40.51,9.59 37.47,12.64 LED53.2-DOUT
N$53
  Top 0.127: LED55.4-DIN 48.51,9.4 48.51,9.59 45.47,12.64 LED54.2-DOUT
N$54
  Top 0.127: LED56.4-DIN 56.52,9.4 56.52,9.59 53.47,12.64 LED55.2-DOUT
N$55
  Top 0.127: LED58.4-DIN 8.51,1.4 8.51,1.59 5.46,4.64 LED57.2-DOUT
N$56
  Top 0.127: LED59.4-DIN 16.51,1.4 16.51,1.59 13.46,4.64 LED58.2-DOUT
N$57
  Top 0.127: LED60.4-DIN 24.51,1.4 24.51,1.59 21.46,4.64 LED59.2-DOUT
N$58
  Top 0.127: LED61.4-DIN 32.51,1.4 32.51,1.59 29.46,4.64 LED60.2-DOUT
N$59
  Top 0.127: LED62.4-DIN 40.51,1.4 40.51,1.59 37.47,4.64 LED61.2-DOUT
N$60
  Top 0.127: LED63.4-DIN 48.51,1.4 48.51,1.59 45.47,4.64 LED62.2-DOUT
N$63
  Top 0.127: LED64.4-DIN 56.52,1.4 56.52,1.59 53.47,4.64 LED63.2-DOUT
N$64
  Top 0.127: LED17.2-DOUT 5.46,44.64 5.46,44.45 8.51,41.4 LED18.4-DIN
N$65
  Top 0.127: LED19.4-DIN 16.51,41.4 16.51,41.59 13.46,44.64 LED18.2-DOUT
N$66
  Top 0.127: LED20.4-DIN 24.51,41.4 24.51,41.59 21.46,44.64 LED19.2-DOUT
N$67
  Top 0.127: LED21.4-DIN 32.51,41.4 32.51,41.59 29.46,44.64 LED20.2-DOUT
N$68
  Top 0.127: LED22.4-DIN 40.51,41.4 40.51,41.59 37.47,44.64 LED21.2-DOUT
N$69
  Top 0.127: LED23.4-DIN 48.51,41.4 48.51,41.59 45.47,44.64 LED22.2-DOUT
N$70
  Top 0.127: LED24.4-DIN 56.52,41.4 56.52,41.59 53.47,44.64 LED23.2-DOUT
N$71
  Bottom 0.127: U3.P$1 59.94,13.02 59.18,13.02 57.47,14.73 54.04,14.73 R6.P$2
N$74
  Bottom 0.127: U2.P$1 44.96,13.02 46.42,13.02 48.13,14.73 48.96,14.73 R1.P$2
N$76  (via drill 0.3)
  Top 0.127: v44.2,4.95 44.2,5.71 44.9,6.41 44.9,8.38 44.45,8.83 v44.45,11.81
  Bottom 0.127: 44.45,12.32 43.81,12.95 43.05,12.95 U2.P$2 | 44.45,12.32 47.18,12.32 48.32,13.46 48.32,13.65 48.45,13.78 53.47,13.78 53.98,13.27 R6.P$1 | v44.2,4.95 44.2,2.03 J1.5 | 44.45,12.32 v44.45,11.81
N$94
  Bottom 0.127: R2.P$2 39.05,19.3 39.05,19.75 41.85,22.54 41.85,47.75 43.43,49.34 56.71,49.34 59.5,46.55 X1.3
N$95
  Bottom 0.127: 54.36,12.7 57.78,12.7 58.04,12.95 U3.P$2 | 54.36,12.7 53.53,12.7 53.02,13.21 49.02,13.21 R1.P$1 | 54.36,12.7 54.36,2.03 J1.1
N$98
  Bottom 0.127: D1.C 39.05,12.13 39.05,11.3 46.1,4.25 47.88,4.25 49.21,2.92 49.21,2.03 J1.3
N$99
  Bottom 0.127: R5.P$2 48.96,26.8 48.7,26.8 46.04,29.46 46.04,38.92 44.51,40.45 X1.11
VCC  (via drill 0.33)
  Top 0.254: v4.72,7.85 3.89,7.01 C58.2 | v11.73,7.85 10.9,7.01 C59.2 | v4.72,15.85 3.89,15.01 C49.2 | v18.75,7.85 17.91,7.01 C60.2 | v11.73,15.85 10.9,15.01 C50.2 | v4.72,23.85 3.89,23.01 C40.2 | v24,7.85 C61.2 | v18.75,15.85 17.91,15.01 C51.2 | v11.73,23.85 10.9,23.01 C41.2 | v4.72,31.85 3.89,31.01 C31.2 | v32.69,7.85 C62.2 | v24,15.85 C52.2 | v18.75,23.85 17.91,23.01 C42.2 | v11.73,31.85 10.9,31.01 C32.2 | v4.72,39.85 3.89,39.01 C22.2 | v39.7,7.85 38.86,7.01 C63.2 | v32.69,15.85 C53.2 | v24,23.85 24.84,23.01 C43.2 | v18.75,31.85 17.91,31.01 C33.2 | v11.73,39.85 10.9,39.01 C23.2 | v4.72,47.85 3.89,47.02 C13.2 | v46.71,7.85 45.87,7.01 C64.2 | v39.7,14.1 38.86,14.94 C54.2 | v32.69,23.85 31.85,23.01 C44.2 | v24,31.85 24.84,31.01 C34.2 | v53.72,7.85 52.88,7.01 C65.2 | v18.75,39.85 17.91,39.01 C24.2 | v11.73,47.85 10.9,47.02 C14.2 | v4.72,55.85 3.89,55.02 C4.2 | v46.71,15.85 45.87,15.01 C55.2 | v39.7,23.85 38.86,23.01 C45.2 | v32.69,31.85 31.85,31.01 C35.2 | v24,39.85 24.84,39.01 C25.2 | v60.73,7.85 59.89,7.01 C66.2 | v53.72,15.85 52.88,15.01 C56.2 | v18.75,47.85 17.91,47.02 C15.2 | v11.73,55.85 10.9,55.02 C5.2 | v46.71,23.85 45.87,23.01 C46.2 | v39.7,31.85 38.86,31.01 C36.2 | v32.69,39.85 31.85,39.01 C26.2 | v24,47.85 24.84,47.02 C16.2 | v60.73,15.85 59.89,15.01 C57.2 | v18.75,55.85 17.91,55.02 C6.2 | v53.72,23.85 52.88,23.01 C47.2 | v46.71,31.85 45.87,31.01 C37.2 | v39.7,39.85 38.86,39.01 C27.2 | v32.69,47.85 31.85,47.02 C17.2 | v24,55.85 24.84,55.02 C7.2 | v60.73,23.85 59.89,23.01 C48.2 | v53.72,31.85 52.88,31.01 C38.2 | v46.71,39.85 45.87,39.01 C28.2 | v39.7,47.85 38.86,47.02 C18.2 | v32.69,55.85 31.85,55.02 C8.2 | v60.73,31.85 59.89,31.01 C39.2
  Top 0.254: v53.72,39.85 52.88,39.01 C29.2 | v46.71,47.85 45.87,47.02 C19.2 | v39.7,55.85 38.86,55.02 C9.2 | v60.96,39.01 59.89,39.01 C30.2 | v53.72,47.85 52.88,47.02 C20.2 | v60.96,47.02 59.89,47.02 C21.2 | v5.49,2.29 5.49,1.37 LED57.1-VDD | v13.49,2.29 13.49,1.37 LED58.1-VDD | v5.49,10.29 5.49,9.37 LED49.1-VDD | v21.49,2.29 21.49,1.37 LED59.1-VDD | v13.49,8.38 13.49,9.3 LED50.1-VDD | v5.49,16.38 5.49,17.3 LED41.1-VDD | v29.49,2.29 29.49,1.37 LED60.1-VDD | v21.49,10.29 21.49,9.37 LED51.1-VDD | v13.49,18.29 13.49,17.37 LED42.1-VDD | v5.49,26.29 5.49,25.38 LED33.1-VDD | v37.49,2.29 37.49,1.37 LED61.1-VDD | v29.49,10.29 29.49,9.37 LED52.1-VDD | v21.49,18.29 21.49,17.37 LED43.1-VDD | v13.49,26.29 13.49,25.38 LED34.1-VDD | v5.49,34.29 5.49,33.38 LED25.1-VDD | v45.49,2.29 45.49,1.37 LED62.1-VDD | v37.49,10.29 37.49,9.37 LED53.1-VDD | v29.49,18.29 29.49,17.37 LED44.1-VDD | v21.49,26.29 21.49,25.38 LED35.1-VDD | v13.49,34.29 13.49,33.38 LED26.1-VDD | v5.49,42.29 5.49,41.38 LED17.1-VDD | v45.49,8.38 45.49,9.3 LED54.1-VDD | v37.49,18.29 37.49,17.37 LED45.1-VDD | v29.49,24.38 29.49,25.3 LED36.1-VDD | v55.32,1.37 53.49,1.37 LED63.1-VDD | v21.49,34.29 21.49,33.38 LED27.1-VDD | v13.49,42.29 13.49,41.38 LED18.1-VDD | v5.49,50.29 5.49,49.38 LED9.1-VDD | v45.49,16.38 45.49,17.3 LED46.1-VDD | v37.49,26.29 37.49,25.38 LED37.1-VDD | v60.5,2.29 61.42,1.37 LED64.1-VDD | v53.49,10.29 53.49,9.37 LED55.1-VDD | v29.49,34.29 29.49,33.38 LED28.1-VDD | v21.49,42.29 21.49,41.38 LED19.1-VDD | v13.49,50.29 13.49,49.38 LED10.1-VDD | v45.49,26.29 45.49,25.38 LED38.1-VDD | v60.5,10.29 61.42,9.37 LED56.1-VDD | v53.49,18.29 53.49,17.37 LED47.1-VDD | v37.49,34.29 37.49,33.38 LED29.1-VDD
  Top 0.254: v29.49,42.29 29.49,41.38 LED20.1-VDD | v21.49,50.29 21.49,49.38 LED11.1-VDD | v13.49,58.29 13.49,57.38 LED2.1-VDD | v60.5,18.29 61.42,17.37 LED48.1-VDD | v52.5,26.29 53.42,25.38 LED39.1-VDD | v45.49,34.29 45.49,33.38 LED30.1-VDD | v37.49,42.29 37.49,41.38 LED21.1-VDD | v29.49,50.29 29.49,49.38 LED12.1-VDD | v21.49,58.29 21.49,57.38 LED3.1-VDD | v60.5,26.29 61.42,25.38 LED40.1-VDD | v46.41,42.29 45.49,41.38 LED22.1-VDD | v37.49,50.29 37.49,49.38 LED13.1-VDD | v29.49,58.29 29.49,57.38 LED4.1-VDD | v53.49,34.29 53.49,33.38 LED31.1-VDD | v46.41,50.29 45.49,49.38 LED14.1-VDD | v37.49,58.29 37.49,57.38 LED5.1-VDD | v60.5,34.29 61.42,33.38 LED32.1-VDD | v53.49,42.29 53.49,41.38 LED23.1-VDD | v58.14,41.38 61.42,41.38 LED24.1-VDD | v53.49,50.29 53.49,49.38 LED15.1-VDD | v58.14,49.38 61.42,49.38 LED16.1-VDD
  Top 0.406: LED1.1-VDD 3.65,57.35 v3,58 | LED6.1-VDD 45.45,55.4 C10.2 46,55 47,54 47,50.89 v46.41,50.29 | LED7.1-VDD 53.45,55.6 C11.2 52.85,54.85 52,54 52,52 53,51 53.78,50 v53.49,50.29 | LED8.1-VDD 61.45,56.6 C12.2 59.85,51.09 v58.14,49.38
  Route2 0.406: v3,58 3,57
  Bottom 0.254: v54.71,21.49 54.03,20.8 R8.P$2 | v30.48,27.13 31.55,26.06 C1.A | v7.24,16.84 8.38,17.98 F1.1 | v31.24,20.12 32.31,20.12 U1.3
  pour Route2: -1,63 42,63 arc-90 44,61 44,51 63,51 63,-1 -1,-1

### Text on the board
bNames: MyForecast | www.soniktech.com | WiFi Microcontroller | I need this stuff / for reasons | Setup: / / Connect to the WiFi Hotspot / that starts with ESP_ / / Open a web browser and / type in the address / http://192.168.4.1 / / Follow the onscreen instructions! | Voltage stuff | Developer Zone | 5V Only!! | RS | P0 | BK | >1.5A recommended | GN